# Altium schematic sheet 02. CPU.SchDoc
size A3
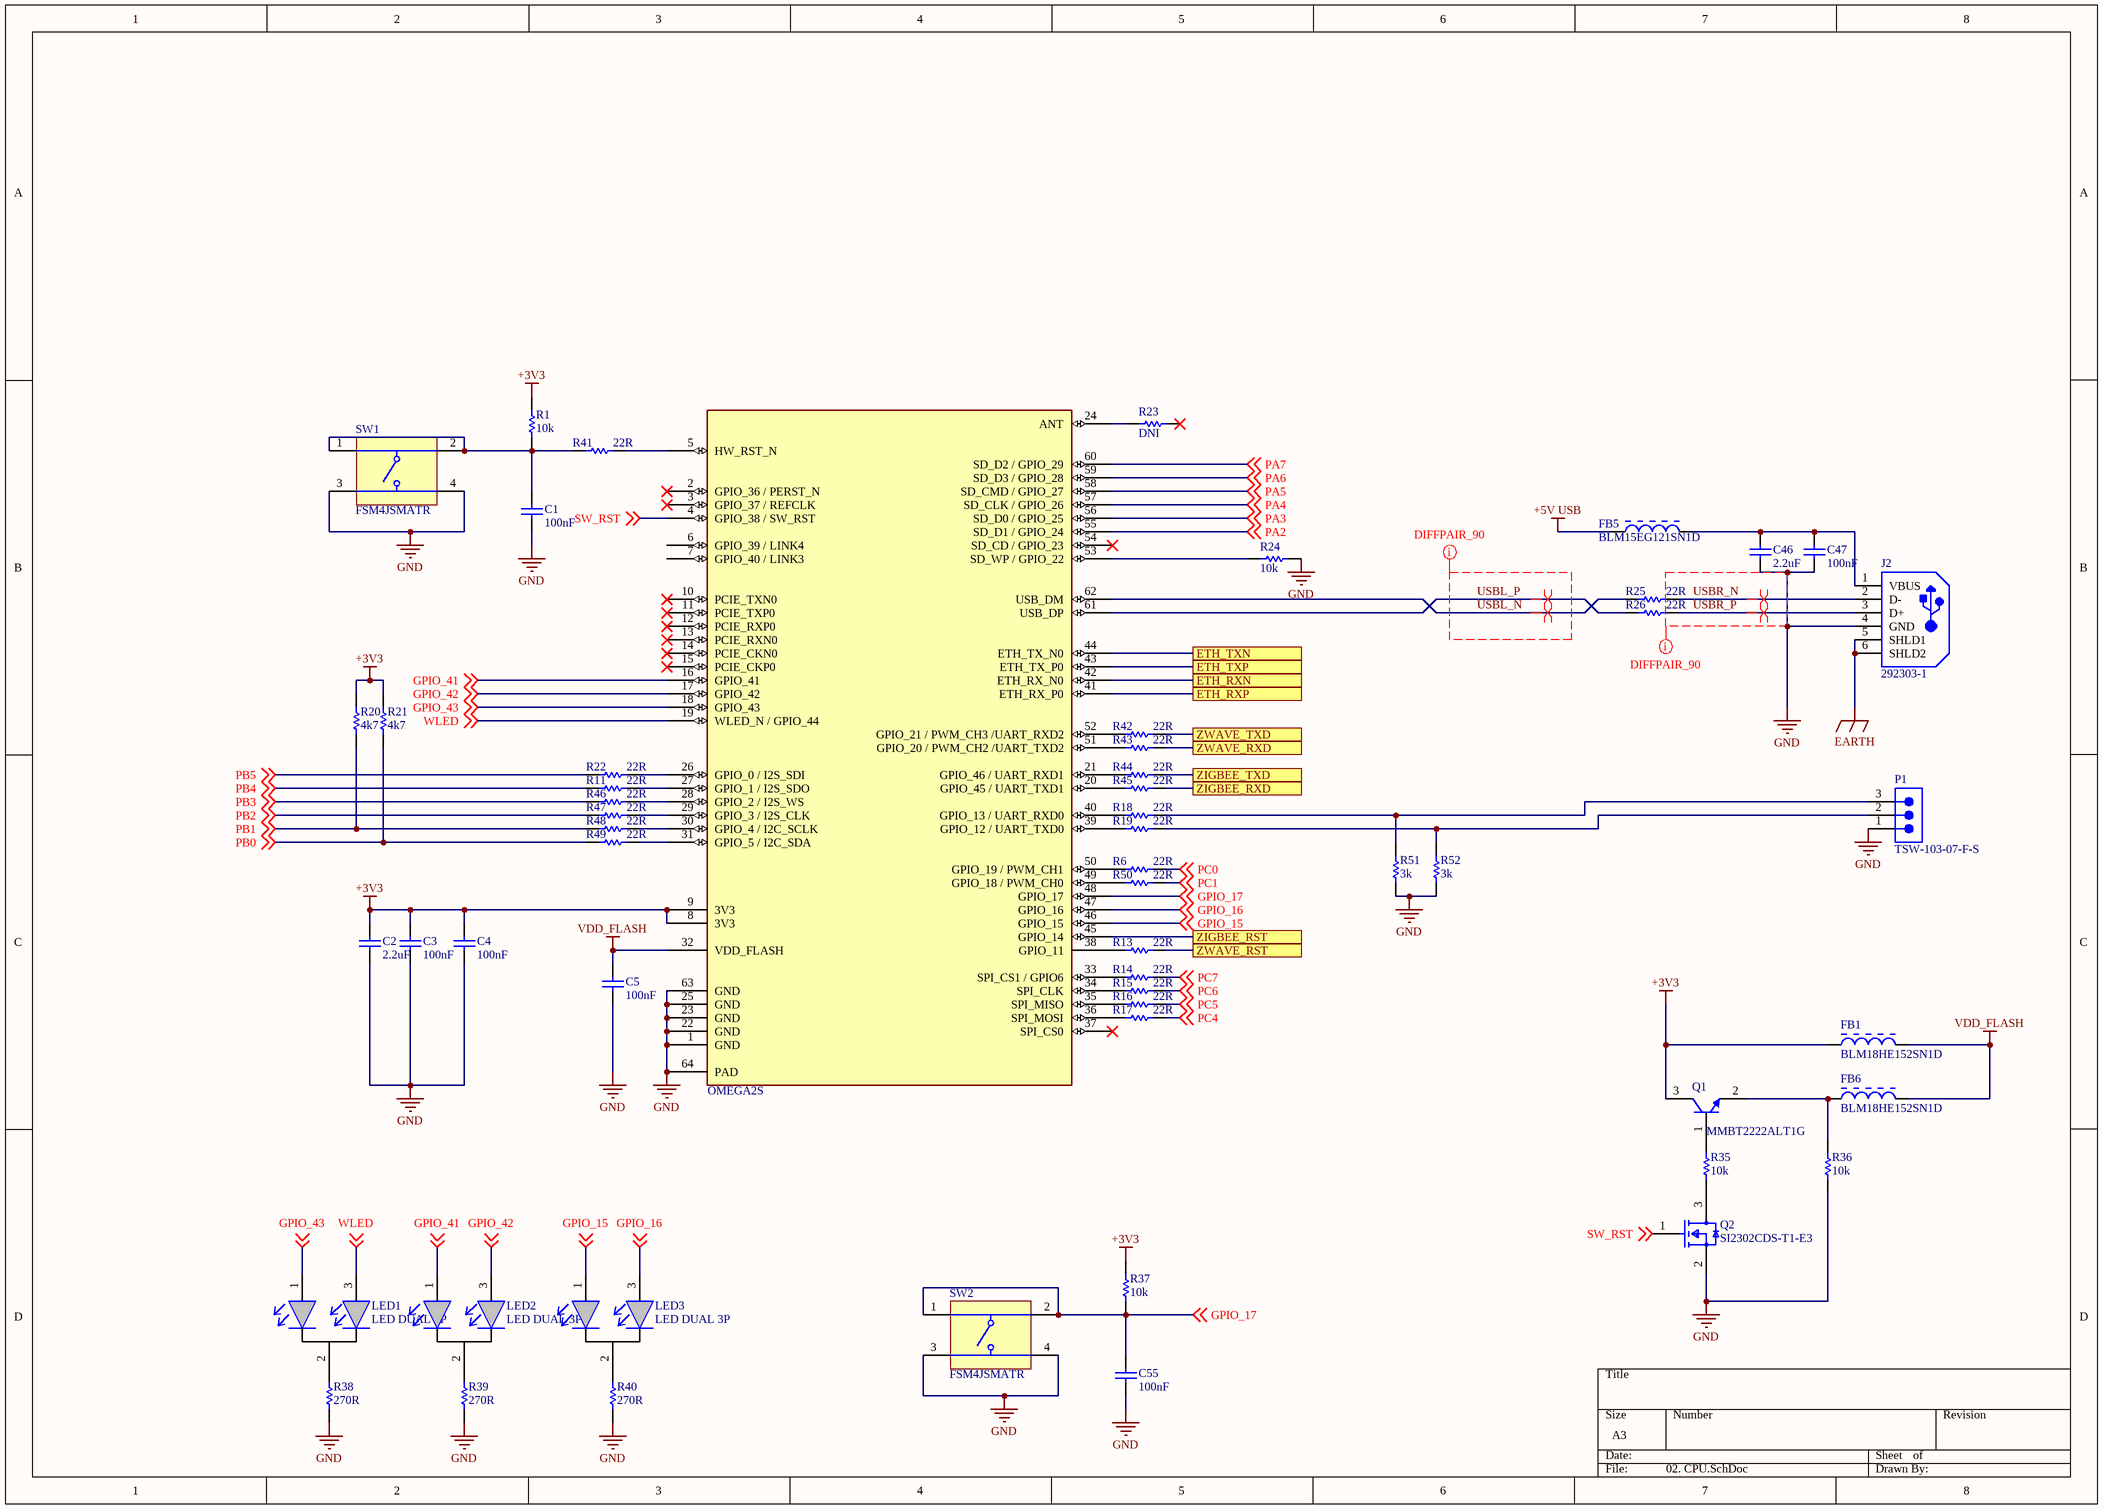
[diagram p0: 02. CPU.SchDoc]

## Parts
?  OMEGA2S  [OMEGA2S]
C1  100nF  [CAPC1005X56X25NL10T15]
C2  2.2uF  [CAPC1608X90X35NL10T15]
C3  100nF  [CAPC1005X56X25NL10T15]
C4  100nF  [CAPC1005X56X25NL10T15]
C5  100nF  [CAPC1005X56X25NL10T15]
C46  2.2uF  [CAPC1608X90X35NL10T15]
C47  100nF  [CAPC1005X56X25NL10T15]
C55  100nF  [CAPC1005X56X25NL10T15]
FB1  BLM18HE152SN1D  [MURA-BLM18-RF-H4-CHIP-2_V]
FB5  BLM15EG121SN1D  [MURA-BLM15-CHIP-2_V]
FB6  BLM18HE152SN1D  [MURA-BLM18-RF-H4-CHIP-2_V]
J2  292303-1  [TE-292303-1_V]
LED1  LED DUAL 3P  [LED 3P 2.54]
LED2  LED DUAL 3P  [LED 3P 2.54]
LED3  LED DUAL 3P  [LED 3P 2.54]
P1  TSW-103-07-F-S  [SMTC-TSW-103-07-X-S]
Q1  MMBT2222ALT1G  [ONSC-SOT-23-3-318-08_V]
Q2  SI2302CDS-T1-E3  [FP-S-03946-MFG]
R1  10k  [RESC1005X40X25NL05T05]
R6  22R  [RESC1005X40X25LL05T05]
R11  22R  [RESC1005X40X25LL05T05]
R13  22R  [RESC1005X40X25LL05T05]
R14  22R  [RESC1005X40X25LL05T05]
R15  22R  [RESC1005X40X25LL05T05]
R16  22R  [RESC1005X40X25LL05T05]
R17  22R  [RESC1005X40X25LL05T05]
R18  22R  [RESC1005X40X25LL05T05]
R19  22R  [RESC1005X40X25LL05T05]
R20  4k7  [RESC1005X40X25NL05T05]
R21  4k7  [RESC1005X40X25NL05T05]
R22  22R  [RESC1005X40X25LL05T05]
R23  DNI  [RESC1005X40X25NL05T05]
R24  10k  [RESC1005X40X25NL05T05]
R25  22R  [RESC1005X40X25NL05T05]
R26  22R  [RESC1005X40X25NL05T05]
R35  10k  [RESC1005X40X25NL05T05]
R36  10k  [RESC1005X40X25NL05T05]
R37  10k  [RESC1005X40X25NL05T05]
R38  270R  [RESC1609X55X30NL15T15]
R39  270R  [RESC1609X55X30NL15T15]
R40  270R  [RESC1609X55X30NL15T15]
R41  22R  [RESC1005X40X25LL05T05]
R42  22R  [RESC1005X40X25LL05T05]
R43  22R  [RESC1005X40X25LL05T05]
R44  22R  [RESC1005X40X25LL05T05]
R45  22R  [RESC1005X40X25LL05T05]
R46  22R  [RESC1005X40X25LL05T05]
R47  22R  [RESC1005X40X25LL05T05]
R48  22R  [RESC1005X40X25LL05T05]
R49  22R  [RESC1005X40X25LL05T05]
R50  22R  [RESC1005X40X25LL05T05]
R51  3k  [RESC1005X40X25LL05T05]
R52  3k  [RESC1005X40X25LL05T05]
SW1  FSM4JSMATR  [TECO-FSM4JSMATR_V]
SW2  FSM4JSMATR  [TECO-FSM4JSMATR_V]

## Ports
ETH_RXN, ETH_RXP, ETH_TXN, ETH_TXP, ZIGBEE_RST, ZIGBEE_RXD, ZIGBEE_TXD, ZWAVE_RST, ZWAVE_RXD, ZWAVE_TXD

## Nets
+3V3: ?.8(3V3) ?.9(3V3) C2.2 C3.2 C4.2 FB1.1 Q1.3(C) R1.2 R20.2 R21.2 R37.2
+5V USB: FB5.1
EARTH: J2.5(SHLD1) J2.6(SHLD2)
GND: ?.1(GND) ?.22(GND) ?.23(GND) ?.25(GND) ?.63(GND) ?.64(PAD) C1.1 C2.1 C3.1 C4.1 C5.1 C46.1 C47.1 C55.1 J2.4(GND) P1.1 Q2.2(S) R24.1 R36.2 R38.1 R39.1 R40.1 R51.1 R52.1 SW1.3 SW1.4 SW2.3 SW2.4
VDD_FLASH: ?.32(VDD_FLASH) C5.2 FB1.2 FB6.2
ETH_RXN: ?.42(ETH_RX_N0) ; port ETH_RXN
ETH_RXP: ?.41(ETH_RX_P0) ; port ETH_RXP
ETH_TXN: ?.44(ETH_TX_N0) ; port ETH_TXN
ETH_TXP: ?.43(ETH_TX_P0) ; port ETH_TXP
GPIO_15: ?.46(GPIO_15) LED3.1 ; off-sheet GPIO_15
GPIO_16: ?.47(GPIO_16) LED3.3 ; off-sheet GPIO_16
GPIO_17: ?.48(GPIO_17) C55.2 R37.1 SW2.1 SW2.2 ; off-sheet GPIO_17
GPIO_41: ?.16(GPIO_41) LED2.1 ; off-sheet GPIO_41
GPIO_42: ?.17(GPIO_42) LED2.3 ; off-sheet GPIO_42
GPIO_43: ?.18(GPIO_43) LED1.1 ; off-sheet GPIO_43
PA2: ?.55(SD_D1_/_GPIO_24) ; off-sheet PA2
PA3: ?.56(SD_D0_/_GPIO_25) ; off-sheet PA3
PA4: ?.57(SD_CLK_/_GPIO_26) ; off-sheet PA4
PA5: ?.58(SD_CMD_/_GPIO_27) ; off-sheet PA5
PA6: ?.59(SD_D3_/_GPIO_28) ; off-sheet PA6
PA7: ?.60(SD_D2_/_GPIO_29) ; off-sheet PA7
PB0: R21.1 R49.1 ; off-sheet PB0
PB1: R20.1 R48.1 ; off-sheet PB1
PB2: R47.1 ; off-sheet PB2
PB3: R46.1 ; off-sheet PB3
PB4: R11.1 ; off-sheet PB4
PB5: R22.1 ; off-sheet PB5
PC0: R6.2 ; off-sheet PC0
PC1: R50.2 ; off-sheet PC1
PC4: R17.2 ; off-sheet PC4
PC5: R16.2 ; off-sheet PC5
PC6: R15.2 ; off-sheet PC6
PC7: R14.2 ; off-sheet PC7
SW_RST: ?.4(GPIO_38_/_SW_RST) Q2.1(G) ; off-sheet SW_RST
USBL_N: ?.62(USB_DM) R25.2
USBL_P: ?.61(USB_DP) R26.2
USBR_N: J2.2(D-) R25.1
USBR_P: J2.3(D+) R26.1
WLED: ?.19(WLED_N_/_GPIO_44) LED1.3 ; off-sheet WLED
ZIGBEE_RST: ?.45(GPIO_14) ; port ZIGBEE_RST
ZIGBEE_RXD: R45.2 ; port ZIGBEE_RXD
ZIGBEE_TXD: R44.2 ; port ZIGBEE_TXD
ZWAVE_RST: R13.2 ; port ZWAVE_RST
ZWAVE_RXD: R43.2 ; port ZWAVE_RXD
ZWAVE_TXD: R42.2 ; port ZWAVE_TXD
Net?_5: ?.5(HW_RST_N) R41.2
Net?_20: ?.20(GPIO_45_/_UART_TXD1) R45.1
Net?_21: ?.21(GPIO_46_/_UART_RXD1) R44.1
Net?_24: ?.24(ANT) R23.2
Net?_26: ?.26(GPIO_0_/_I2S_SDI) R22.2
Net?_27: ?.27(GPIO_1_/_I2S_SDO) R11.2
Net?_28: ?.28(GPIO_2_/_I2S_WS) R46.2
Net?_29: ?.29(GPIO_3_/_I2S_CLK) R47.2
Net?_30: ?.30(GPIO_4_/_I2C_SCLK) R48.2
Net?_31: ?.31(GPIO_5_/_I2C_SDA) R49.2
Net?_33: ?.33(SPI_CS1_/_GPIO6) R14.1
Net?_34: ?.34(SPI_CLK) R15.1
Net?_35: ?.35(SPI_MISO) R16.1
Net?_36: ?.36(SPI_MOSI) R17.1
Net?_38: ?.38(GPIO_11) R13.1
Net?_39: ?.39(GPIO_12_/_UART_TXD0) R19.1
Net?_40: ?.40(GPIO_13_/_UART_RXD0) R18.1
Net?_49: ?.49(GPIO_18_/_PWM_CH0) R50.1
Net?_50: ?.50(GPIO_19_/_PWM_CH1) R6.1
Net?_51: ?.51(GPIO_20_/_PWM_CH2_/UART_TXD2) R43.1
Net?_52: ?.52(GPIO_21_/_PWM_CH3_/UART_RXD2) R42.1
Net?_53: ?.53(SD_WP_/_GPIO_22) R24.2
NetC1_2: C1.2 R1.1 R41.1 SW1.1 SW1.2
NetC46_2: C46.2 C47.2 FB5.2 J2.1(VBUS)
NetFB6_1: FB6.1 Q1.2(E) R36.1
NetLED1_2: LED1.2 R38.2
NetLED2_2: LED2.2 R39.2
NetLED3_2: LED3.2 R40.2
NetP1_2: P1.2 R19.2 R52.2
NetP1_3: P1.3 R18.2 R51.2
NetQ1_1: Q1.1(B) R35.1
NetQ2_3: Q2.3(D) R35.2

Not connected (* = marked no-connect by the designer): ? 2(GPIO_36_/_PERST_N)* 3(GPIO_37_/_REFCLK)* 6(GPIO_39_/_LINK4) 7(GPIO_40_/_LINK3) 10(PCIE_TXN0)* 11(PCIE_TXP0)* 12(PCIE_RXP0)* 13(PCIE_RXN0)* 14(PCIE_CKN0)* 15(PCIE_CKP0)* 37(SPI_CS0)* 54(SD_CD_/_GPIO_23)*; R23 1*

## Layout directives
differential pair: USBL_N, USBL_P, USBR_N, USBR_P
net class USB; rule Matched Net Lengths [Tolerance = 10mil]: USBL_N, USBL_P, USBR_N, USBR_P

## Library data of the parts
? = OMEGA2S: MediaTek Transceiver; 802.11 b/g/n _Wi-Fi, WiFi, WLAN_ For Use With MT7688; MF: Onion; SnapEDA_Link: https://www.snapeda.com/parts/OMEGA2S/Onion/view-part/3600410/?ref=snap; MP: OMEGA2S; Price: None; Value: *; Availability: Unavailable; Package: Module Onion
C1 C3-C5 C47 C55 = CMP-2008-02743-1: Manufacturer: AVX Interconnect / Elco; Part Number: 04026D104KAT2A
C2 C46 = CMP-2006-02354-1: Manufacturer: Murata; Part Number: GCM188R70J225KE22D
FB1 FB6 = CMP-0686-00368-2: Chip Ferrite Bead for GHz Band High-speed Signal Lines, 1500 Ohm, 500 mA, -55 to 125 degC, 1.6 x 0.8 x 0.95 mm SMD, Tape and Reel; Manufacturer: Murata; Rated Current: 500 mA; Impedance (at 100 MHz): 1500 Ohm +/- 25%; DC Resistance: 0.50 Ohm Max.; Packing: Tape and Reel; DatasheetVersion: 08/2013; ComponentLink1URL: http://www.murata.com/; Mounting Technology: Surface Mount; ComponentLink2URL: http://www.murata.com/products/catalog/pdf/c31e.pdf; ComponentLink3Description: Package Specification; ComponentLink2Description: Datasheet; PackageReference: BLM18_H950-2; ComponentLink1Description: Manufacturer URL; PackageDescription: 2-Pin Chip, Body 1.6 x 0.8 mm; ComponentLink3URL: http://www.murata.com/products/catalog/pdf/c31e.pdf; PartNumber: BLM18HE152SN1D; Operating Temperature Range: -55 to 125 degC
FB5 = CMP-0686-00148-3: Chip Ferrite Bead for GHz Band General Use (Low DC Resistance Type), 120 Ohm, 1500 mA, -55 to 125 degC, 1 x 0.5 x 0.55 mm SMD, Tape and Reel; Manufacturer: Murata; Rated Current: 1500 mA; Impedance (at 100 MHz): 120 Ohm +/- 25%; DC Resistance: 0.095 Ohm Max.; ComponentLink3URL: http://www.murata.com/products/catalog/pdf/c31e.pdf; ComponentLink1URL: http://www.murata.com/; Packing: Tape and Reel; Operating Temperature Range: -55 to 125 degC; PackageReference: BLM15-2; ComponentLink2Description: Datasheet; PackageDescription: 2-Pin Chip, Body 1 x 0.5 mm; ComponentLink2URL: http://www.murata.com/products/catalog/pdf/c31e.pdf; Mounting Technology: Surface Mount; ComponentLink3Description: Package Specification; ComponentLink1Description: Manufacturer URL; PartNumber: BLM15EG121SN1D; DatasheetVersion: 08/2013
J2 = CMP-2000-05404-1: 1 Port Right Angle Through Hole Mount Female Type A USB Connector, 4 Position, -55 to 85 degC, RoHS, Tube; Manufacturer: TE Connectivity; Contact Termination Type: Solder; No. of Contacts: 4; Connector Mounting: PCB; SVHC: NoSVHC(16-Jun-2014); Gender: Receptacle; Connector Type: USBA; Package Description: 4-Pin Through Hole Device, Body 14 x 13.13 mm, Pitch 2.5 mm; Contact Plating: Gold; Package Reference: 292303-1; Contact Material: Copper; Datasheet URL: http://www.farnell.com/cad/1653030.pdf; Datasheet Version: Feb-12; Manufacturer URL: http://www.te.com/
P1 = CMP-1024-00331-1: 0.025" SQ Post Header, Through-hole, Vertical, -55 to 125 degC, 2.54 mm Pitch, 3-Pin, Male, RoHS; Manufacturer: Samtec; Pitch: 2.54 mm; DatasheetVersion: F-214; ComponentLink1Description: Manufacturer URL; ComponentLink3URL: http://www.samtec.com/documents/webfiles/cpdf/TSW-XXX-XX-XXX-X-XX-XXX-MKT.pdf; Mounting Technology: Through-hole; PackageDescription: .025[0.64] SQ. Post Terminal Strip Assembly; Temperature Range: -55 to 125 degC; ComponentLink3Description: Package Specification; Orientation: Vertical; PartNumber: TSW-103-07-F-S; RoHS: True; PackageVersion: DM, 8/1988; ComponentLink2Description: Datasheet; ComponentLink1URL: http://www.samtec.com; ComponentLink2URL: http://www.samtec.com/documents/webfiles/pdf/TSW_TH.PDF; PackageReference: TSW-103-07-X-S
Q1 = CMP-1048-00538-1: General Purpose Transistor, NPN Silicon, 3-Pin SOT-23, Pb-Free, Tape and Reel; Manufacturer: On Semiconductor; fT Min (MHz): 300; IC Continuous (A): 0.6; ComponentLink3URL: http://www.onsemi.cn/pub_link/Collateral/318-08.PDF; PartNumber: MMBT2222ALT1G; RoHS: TRUE; ComponentLink1URL: http://www.onsemi.com/; ComponentLink3Description: Package Specification; ComponentLink2Description: Datasheet; Mounting Technology: Surface Mount; Packing: Tape and Reel; PackageDescription: 3-Pin Small Outline Transistor, Body 2.92 x 1.3 mm, Pitch 0.95 mm; DatasheetVersion: Rev. 10; PackageReference: SOT-23-3-318-08; ComponentLink2URL: http://www.onsemi.cn/pub_link/Collateral/MMBT2222LT1-D.PDF; Polarity: NPN; PackageVersion: Rev. AP, 11/2009; ComponentLink1Description: Manufacturer URL
Q2 = CMP-02550-000184-1: MOSFET N-CH 20V 2.6A SOT-23; Manufacturer: Vishay; Gate To Source Voltage: 8V; Max Forward Diode Voltage: 1.2V; Pulse Drain Current: 10A; Typ Forward Diode Voltage: 0.7V; Number Of N Channels: 1; Reverse Recovery Charge: 2nC; Power Dissipation: 0.71W; Reverse Recovery Time: 8.5ns; Threshold Vgs Min: 0.4V; Drain To Source Resistance: 0.045Ω; Gate Charge At Vgs: 3.5nC @ 4.5V; Turn Off Delay Time: 30ns; Rthja Max: 140°C/W; Max Junction Temp: +150°C; Transconductance: 13S; Depletion Mode: False; Standoff Height: 0.01mm; Turn On Delay Time: 8ns; Threshold Vgs Max: 0.85V; Manufacturer Part Number: SI2302CDS-T1-E3; Mouser Description: MOSFET 20V 2.9A 0.86W 57mohm @ 4.5V; Digikey Description: MOSFET N-CH 20V 2.6A SOT-23; Drain To Source Voltage: 20V; Lead Free: Yes; Temperature Range High: +150°C; Automotive: No; ComponentLink2URL: http://www.vishay.com/docs/68645/si2302cds.pdf; Height: 1.12mm; ComponentLink2Description: Datasheet; Octopart: https://octopart.com/si2302cds-t1-e3-vishay-44452855; Continuous Drain Current: 2.6A; Drain To Source Breakdown Voltage: 20V; Number Of Channels: 1; Device Class L3: MOSFETs; Device Class L1: Discrete Semiconductors; Temperature Range Low: -55°C; Package: S-03946; RoHS: TRUE; Device Class L2: Transistors; Temperature: -55°C to +150°C; Category: Trans
R1 R20 R21 R23-R26 R35-R37 = CMP-2002-08135-1: Manufacturer: Vishay Dale; Part Number: CRCW040210K0FKED
R6 R11 R13-R19 R22 R41-R52 = CMP-1665-00027-3: Chip Resistor, 22 Ohm, +/- 1%, 0.1 W, -55 to 155 degC, 0402 (1005 Metric), RoHS, Tape and Reel; PartNumber: ERJ-2RKF22R0X; Case\/Package: 0402; Resistance: 22 Ohm; Power Rating: 100 mW; Voltage Rating: 50 V; ComponentLink2Description: Datasheet; Packaging: Tape and Reel; Weight: 2.8E-05oz; Pins: 2; Case Code (Imperial): 0402; Width: 0.5 mm; ComponentLink2URL: http://industrial.panasonic.com/cdbs/www-data/pdf/RDA0000/AOA0000C86.pdf; Height: 0.35 mm; PackageReference: 0402; REACH SVHC: Yes; Min Operating Temperature: -55 degC; Length: 1 mm; DatasheetVersion: 04/2015; RoHSCompliant: true; Package Quantity: 10000; Case Code (Metric): 1005; PackageDescription: 2-Pin Surface Mount Device, Body 1 x 0.5 mm; ComponentLink1URL: http://www.panasonic.com/; Mount: Surface Mount; Mounting Technology: Surface Mount; Tolerance: 1%; Max Operating Temperature: 155 degC; ComponentLink1Description: Manufacturer URL
R38-R40 = CMP-2000-07452-1: Chip Resistor, 10 KOhm, +/- 1%, 0.1 W, -55 to 155 degC, 0603 (1608 Metric), RoHS, Tape and Reel; Manufacturer: Panasonic; Voltage Rating: 75V; Case\/Package: 0603; Power Rating: 100mW; Resistance: 10KOhm; Temperature Coefficient: 100ppm\/degreesC; Number of Pins: 2; Package Reference: 603; Depth: 0.8mm; Mount: SurfaceMount; Package Description: 2-Pin Surface Mount Device, Body 1.6 x 0.85 mm; Datasheet Version: 02/2017; Length: 1.6mm; Lead Free: LeadFree; Height: 0.45mm; Number of Terminations: 2; Max Power Dissipation: 100mW; Min Operating Temperature: -55degC; Datasheet URL: https://industrial.panasonic.com/cdbs/www-data/pdf/RDA0000/AOA0000C304.pdf; Termination: SMD/SMT; Case Code (Metric): 1608; Case Code (Imperial): 0603; Tolerance: 1%; Max Operating Temperature: 155degC; RoHSCompliant: true; Voltage Rating (DC): 75V; Radiation Hardening: No; Packaging: TapeandReel; Composition: ThickFilm; Mounting Technology: SurfaceMount; Manufacturer URL: http://www.panasonic.com/; Width: 0.031inch; REACH SVHC: NoSVHC; Contact Plating: Tin; Military Standard: Not; Package Quantity: 1
SW1 SW2 = CMP-2000-07486-1: Micro Miniature Push Button Switch FSM JSM, 50 mA, -35 to 85 degC, 4-Pin SMD, RoHS, Tape and Reel; Manufacturer: TE Connectivity; Mechanical Life: 100000Cycles; Current Rating: 50mA; Actuator Material: Polyamide; Max Voltage Rating (DC): 12V; Capacitance: 0f; Illumination Type: Illuminated; Voltage Rating (DC): 24V; Case\/Package: SMD/SMT; Operating Force: 160gf; Contact Resistance: 100mOhm; Actuator Length: 0.055inch; Switch Travel: 0.25mm; Throw Configuration: SPST; Termination: GullWing; Contact Plating: Silver; Orientation: Straight; Mounting Technology: SurfaceMount; REACH SVHC: Unknown; Electrical Life: 100000Cycles; Package Reference: FSM4JSMATR; Max Operating Temperature: 85degC; Manufacturer URL: http://www.te.com/; Package Description: 4-Pin Surface Mount Device, Body 6 x 6 mm, Pitch 4.5 mm; Datasheet Version: Rev. V, 02/2015; Packaging: TapeandReel; Min Operating Temperature: -35degC; Mount: SurfaceMount; Contact Current Rating: 50mA; Contact Material: CopperAlloy; Package Quantity: 1200; Datasheet URL: http://www.te.com/commerce/DocumentDelivery/DDEController?Action=showdoc&DocId=Customer+Drawing%7F2-1437565-7%7FV%7Fpdf%7FEnglish%7FENG_CD_2-1437565-7_V.pdf%7F4-1437565-2; RoHSCompliant: true